# Altium schematic sheet 01_LSH-100.SchDoc: XEM NC pins, JTAG and Debug I/O
size 381 x 266 mm; Organization: Meteroi; Address1: Room 428, 410 Guiping Rd.; Address2: Shanghai 200233, CHINA; SheetNumber: 8; SheetTotal: 9; PageSetup: Record=PageOptions|CenterHorizontal=True|CenterVertical=True|PrintScale=0.75|XCorrection=1.00|YCorrection=1.00|PrintKind=2|BorderSize=5000000|LeftOffset=0|BottomOffset=0|Orientation=2|PaperLength=1000|PaperWidth=1000|Scale=100|PaperSource=276|PrintQuality=-3|MediaType=1|DitherType=10|PaperKind=A4|PrintScaleMode=1
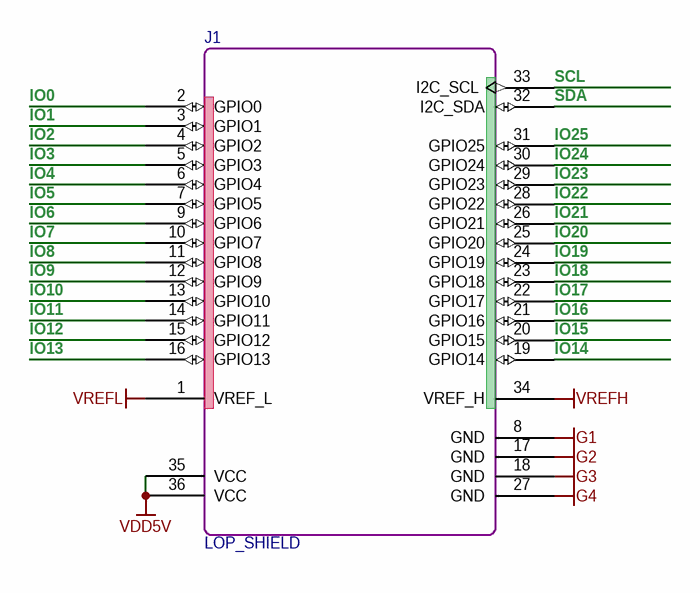
[diagram p0: 01_LSH-100.SchDoc]

## Parts
J1  LOP_SHIELD  [LOP_SHIELD_MOD]

## Nets
G1: J1.8(GND)
G2: J1.17(GND)
G3: J1.18(GND)
G4: J1.27(GND)
VDD5V: J1.35(VCC) J1.36(VCC)
VREFH: J1.34(VREF_H)
VREFL: J1.1(VREF_L)
IO0: J1.2(GPIO0)
IO1: J1.3(GPIO1)
IO2: J1.4(GPIO2)
IO3: J1.5(GPIO3)
IO4: J1.6(GPIO4)
IO5: J1.7(GPIO5)
IO6: J1.9(GPIO6)
IO7: J1.10(GPIO7)
IO8: J1.11(GPIO8)
IO9: J1.12(GPIO9)
IO10: J1.13(GPIO10)
IO11: J1.14(GPIO11)
IO12: J1.15(GPIO12)
IO13: J1.16(GPIO13)
IO14: J1.19(GPIO14)
IO15: J1.20(GPIO15)
IO16: J1.21(GPIO16)
IO17: J1.22(GPIO17)
IO18: J1.23(GPIO18)
IO19: J1.24(GPIO19)
IO20: J1.25(GPIO20)
IO21: J1.26(GPIO21)
IO22: J1.28(GPIO22)
IO23: J1.29(GPIO23)
IO24: J1.30(GPIO24)
IO25: J1.31(GPIO25)
SCL: J1.33(I2C_SCL)
SDA: J1.32(I2C_SDA)

## Notes on the sheet
- Title:
- Project:
- Sheet:
- Of
- Size:
- D/N:
- Rev:
- Date:
- P/N:
- S/N:
- Designer:
- C

## Library data of the parts
J1 = LOP_SHIELD_MOD: Lophilo Shield Module Slot; Vendor: 0; PinCountHole: 36; Designer: shyul; Value: LOP_SHIELD; PartNumber: LOP_SHIELD; Version: 1.0; VersionDate: 03-19-2012; PinCountSMD: 0; SerialNumber: 0; Publisher: Cowin; PCBMarker: LOP_SHIELD